# Altium schematic sheet STM32lab.SchDoc
size A3; SheetNumber: 1; SheetTotal: 1; SPICEModelCacheLXBDUELC: <root> / <DocumentId>LXBDUELC</DocumentId> / </root>
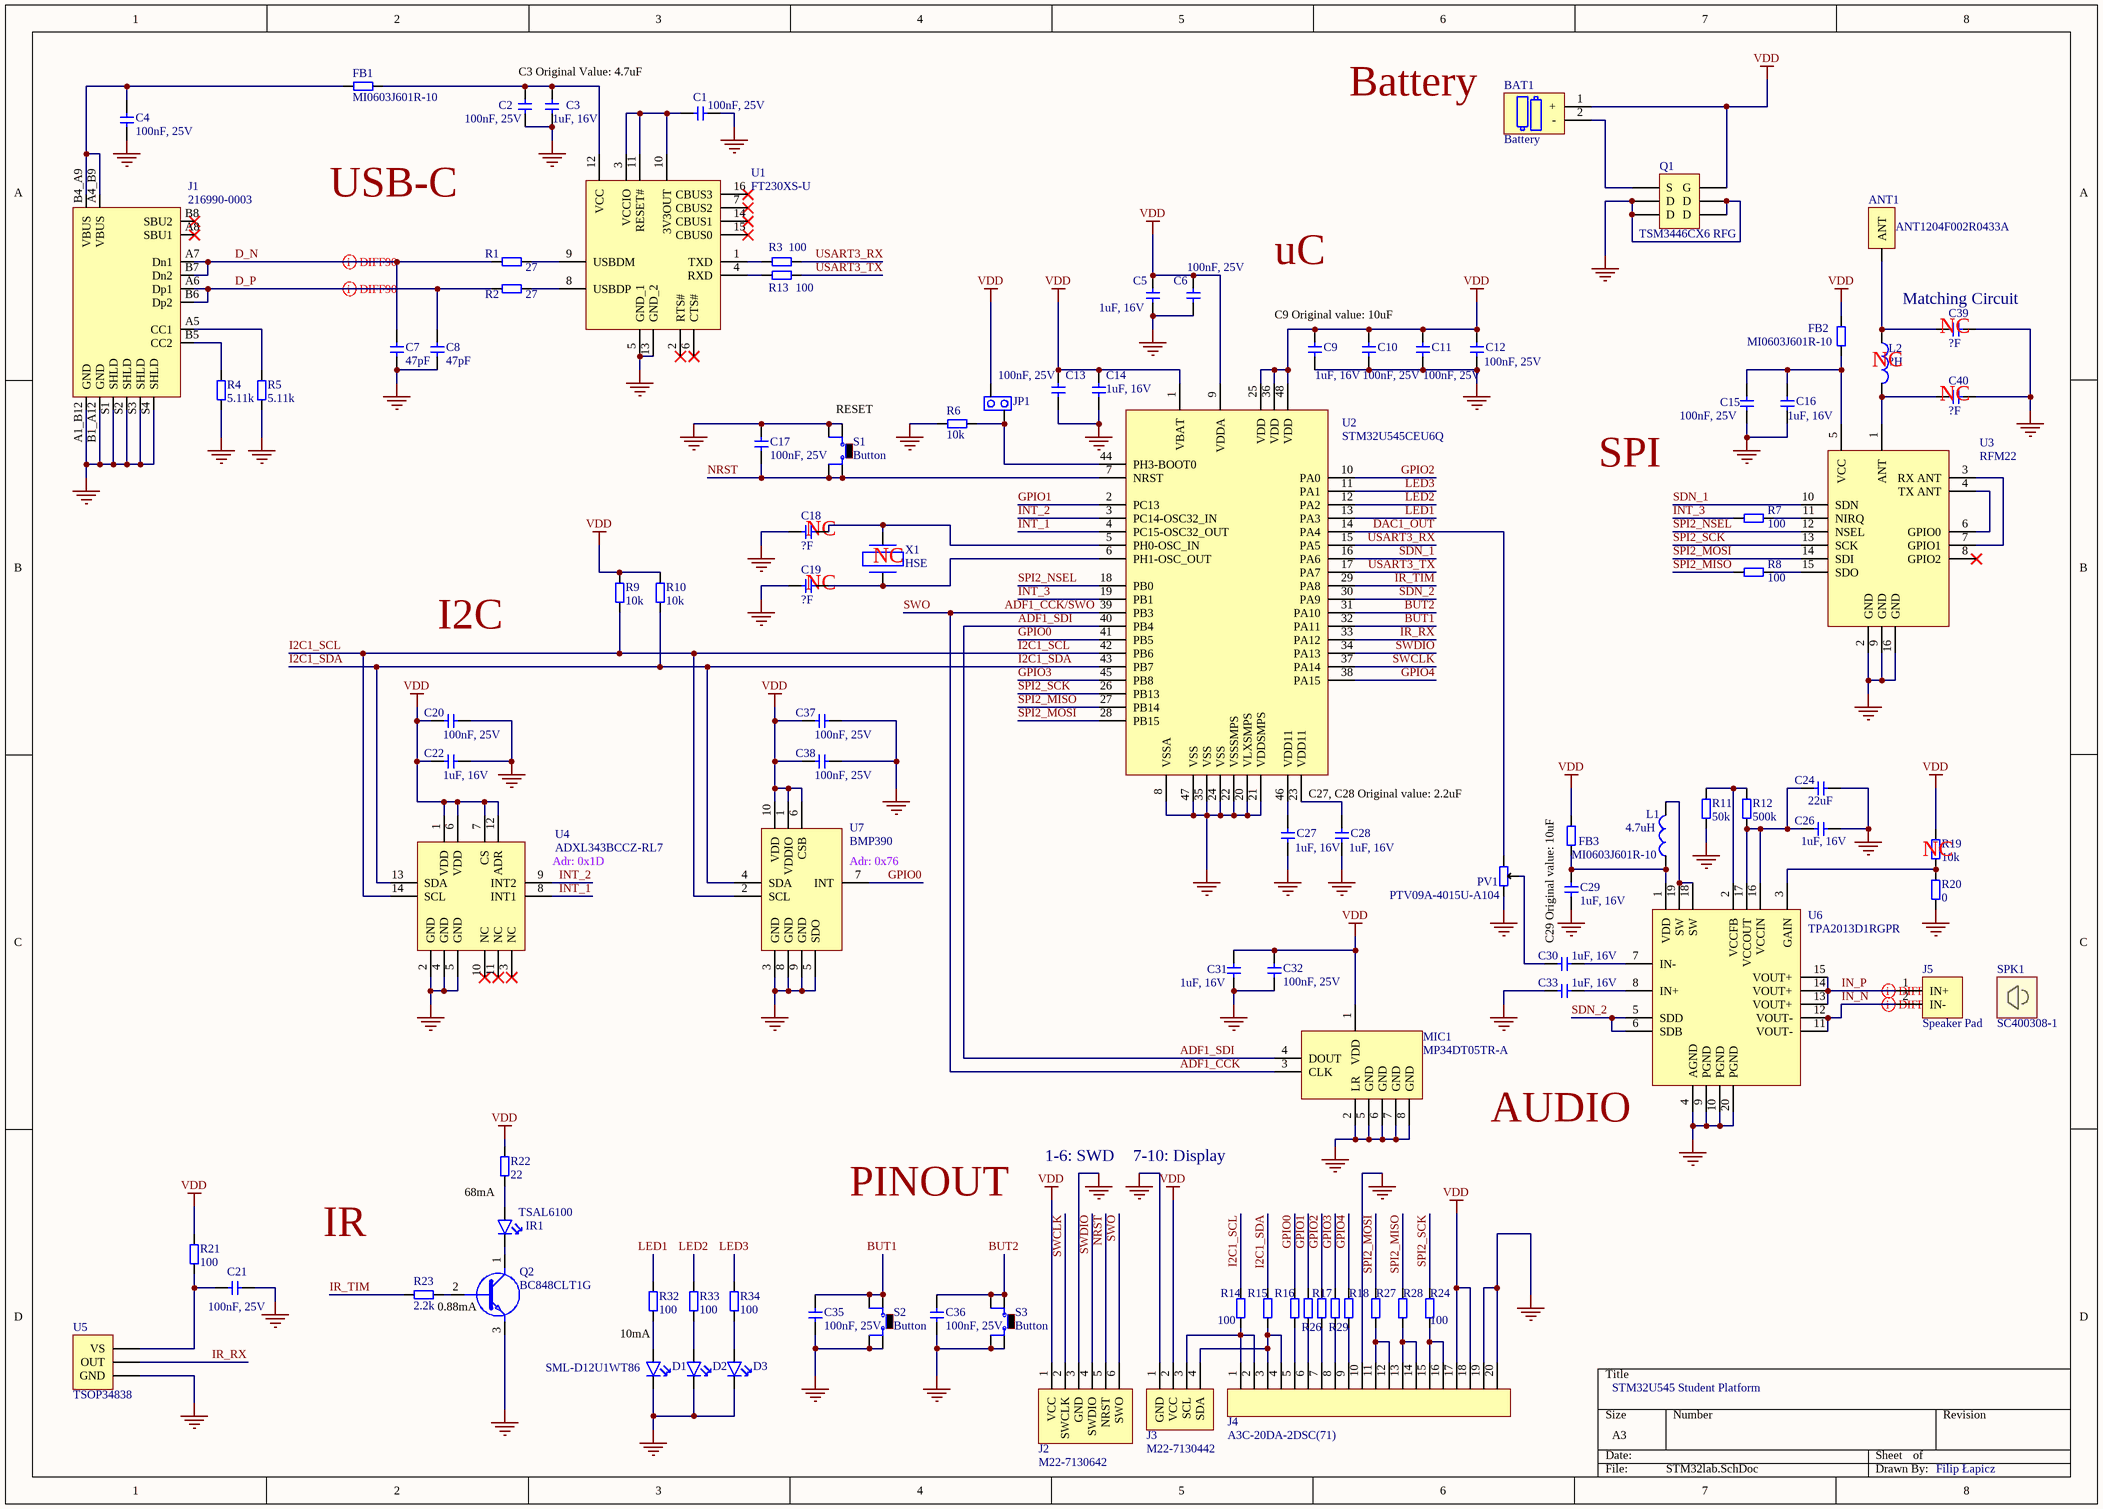
[diagram p0: STM32lab.SchDoc]

## Parts
ANT1  ANT1204F002R0433A  [CHIP_R0433A_YAG]
BAT1  Battery  [2462]
C1  100nF, 25V  [CAPC1608X90N]
C2  100nF, 25V  [CAPC1608X90N]
C3  1uF, 16V  [CAPC1608X90N]
C4  100nF, 25V  [CAPC1608X90N]
C5  1uF, 16V  [CAPC1608X90N]
C6  100nF, 25V  [CAPC1608X90N]
C7  47pF  [CAPC1608X90N]
C8  47pF  [CAPC1608X90N]
C9  1uF, 16V  [CAPC1608X90N]
C10  100nF, 25V  [CAPC1608X90N]
C11  100nF, 25V  [CAPC1608X90N]
C12  100nF, 25V  [CAPC1608X90N]
C13  100nF, 25V  [CAPC1608X90N]
C14  1uF, 16V  [CAPC1608X90N]
C15  100nF, 25V  [CAPC1608X90N]
C16  1uF, 16V  [CAPC1608X90N]
C17  100nF, 25V  [CAPC1608X90N]
C18  ?F  [CAPC1608X90N]
C19  ?F  [CAPC1608X90N]
C20  100nF, 25V  [CAPC1608X90N]
C21  100nF, 25V  [CAPC1608X90N]
C22  1uF, 16V  [CAPC1608X90N]
C24  22uF  [CAPC1608X90N]
C26  1uF, 16V  [CAPC1608X90N]
C27  1uF, 16V  [CAPC1608X90N]
C28  1uF, 16V  [CAPC1608X90N]
C29  1uF, 16V  [CAPC1608X90N]
C30  1uF, 16V  [CAPC1608X90N]
C31  1uF, 16V  [CAPC1608X90N]
C32  100nF, 25V  [CAPC1608X90N]
C33  1uF, 16V  [CAPC1608X90N]
C35  100nF, 25V  [CAPC1608X90N]
C36  100nF, 25V  [CAPC1608X90N]
C37  100nF, 25V  [CAPC1608X90N]
C38  100nF, 25V  [CAPC1608X90N]
C39  ?F  [CAPC1608X90N]
C40  ?F  [CAPC1608X90N]
D1  SML-D12U1WT86  [LEDC1608X65N]
D2  SML-D12U1WT86  [LEDC1608X65N]  (value not drawn)
D3  SML-D12U1WT86  [LEDC1608X65N]  (value not drawn)
FB1  MI0603J601R-10  [RESC1608X55N]
FB2  MI0603J601R-10  [RESC1608X55N]
FB3  MI0603J601R-10  [RESC1608X55N]
IR1  TSAL6100  [TSAL]
J1  216990-0003  [MOLEX_2169900003]
J2  M22-7130642  [6-wire]
J3  M22-7130442  [4-wire]
J4  A3C-20DA-2DSC(71)  [20-wire]
J5  Speaker Pad  [Pad]
JP1  (no value)  [10129378902002BLF]
L1  4.7uH  [RESC1608X55N]
L2  ?H  [RESC1608X55N]
MIC1  MP34DT05TR-A  [MP34DT05TRA]
PV1  PTV09A-4015U-A104  [PTV09A-4015U-A104]
Q1  TSM3446CX6 RFG  [TRANS_TSM3446CX6_RFG]
Q2  BC848CLT1G  [SOT-23TO-236_318-08_ONS]
R1  27  [RESC1608X55N]
R2  27  [RESC1608X55N]
R3  100  [RESC1608X55N]
R4  5.11k  [RESC1608X55N]
R5  5.11k  [RESC1608X55N]
R6  10k  [RESC1608X55N]
R7  100  [RESC1608X55N]
R8  100  [RESC1608X55N]
R9  10k  [RESC1608X55N]
R10  10k  [RESC1608X55N]
R11  50k  [RESC1608X55N]
R12  500k  [RESC1608X55N]
R13  100  [RESC1608X55N]
R14  100  [RESC1608X55N]
R15  100  [RESC1608X55N]  (value not drawn)
R16  100  [RESC1608X55N]  (value not drawn)
R17  100  [RESC1608X55N]  (value not drawn)
R18  100  [RESC1608X55N]  (value not drawn)
R19  10k  [RESC1608X55N]
R20  0  [RESC1608X55N]
R21  100  [RESC1608X55N]
R22  22  [RESC1608X55N]
R23  2.2k  [RESC1608X55N]
R24  100  [RESC1608X55N]  (value not drawn)
R26  100  [RESC1608X55N]
R27  100  [RESC1608X55N]  (value not drawn)
R28  100  [RESC1608X55N]  (value not drawn)
R29  100  [RESC1608X55N]  (value not drawn)
R32  100  [RESC1608X55N]
R33  100  [RESC1608X55N]
R34  100  [RESC1608X55N]
S1  Button  [TS026650BK260SCRD]
S2  Button  [TS026650BK260SCRD]
S3  Button  [TS026650BK260SCRD]
SPK1  SC400308-1  [SC400308]
U1  FT230XS-U  [SOP64P599X175-16N]
U2  STM32U545CEU6Q  [UFQFPN-48_STM]
U3  RFM22  [RFM22B-S2_HRF]
U4  ADXL343BCCZ-RL7  [PQFN80P300X500X100-14N]
U5  TSOP34838  [TO_TSOP31236_VIS]
U6  TPA2013D1RGPR  [QFN50P400X400X100-21N-D]
U7  BMP390  [10LGA_2X2X0p75_BOS]
X1  HSE  [HC49USMFF5F1873728MHZ]

## Nets
GND: C1.1 C2.1 C3.1 C4.1 C5.1 C6.1 C7.1 C8.1 C9.1 C10.1 C11.1 C12.1 C13.1 C14.1 C15.1 C16.1 C17.2 C18.1 C19.1 C20.2 C21.1 C22.2 C24.2 C26.1 C27.1 C28.1 C29.2 C31.1 C32.1 C33.1 C35.1 C36.1 C37.1 C38.1 C39.2 C40.2 D1.2 D2.2 D3.2 J1.A1_B12(GND) J1.B1_A12(GND) J1.S1(SHLD) J1.S2(SHLD) J1.S3(SHLD) J1.S4(SHLD) J2.3(GND) J3.1(GND) J4.10 J4.19 J4.20 MIC1.2(LR) MIC1.5(GND) MIC1.6(GND) MIC1.7(GND) MIC1.8(GND) PV1.3 Q1.2(D) Q1.3(D) Q1.5(D) Q1.6(D) Q2.3(E) R4.1 R5.1 R6.2 R11.1 R20.1 S1.1 S1.2 S2.3 S2.4 S3.3 S3.4 U1.5(GND_1) U1.13(GND_2) U2.8(VSSA) U2.20(VLXSMPS) U2.21(VDDSMPS) U2.22(VSSSMPS) U2.24(VSS) U2.35(VSS) U2.47(VSS) U3.2(GND) U3.9(GND) U3.16(GND) U4.2(GND) U4.4(GND) U4.5(GND) U5.2(GND) U6.4(AGND) U6.9(PGND) U6.10(PGND) U6.20(PGND) U7.3(GND) U7.5(SDO) U7.8(GND) U7.9(GND)
VDD: BAT1.1(+) C5.2 C6.2 C9.2 C10.2 C11.2 C12.2 C13.2 C14.2 C20.1 C22.1 C31.2 C32.2 C37.2 C38.2 FB2.2 FB3.2 J2.1(VCC) J3.2(VCC) J4.17 J4.18 JP1.1 MIC1.1(VDD) Q1.4(G) R9.2 R10.2 R19.2 R21.2 R22.2 U2.1(VBAT) U2.9(VDDA) U2.25(VDD) U2.36(VDD) U2.48(VDD) U4.1(VDD) U4.6(VDD) U4.7(CS) U4.12(ADR) U7.1(VDDIO) U7.6(CSB) U7.10(VDD)
ADF1_CCK: J2.6(SWO) MIC1.3(CLK) U2.39(PB3)  [also labelled ADF1_CCK/SWO, SWO]
ADF1_SDI: MIC1.4(DOUT) U2.40(PB4)
BUT1: C35.2 S2.1 S2.2 U2.32(PA11)
BUT2: C36.2 S3.1 S3.2 U2.31(PA10)
D_N: C7.2 J1.A7(Dn1) J1.B7(Dn2) R1.1
D_P: C8.2 J1.A6(Dp1) J1.B6(Dp2) R2.1
DAC1_OUT: PV1.1 U2.14(PA4)
GPIO0: R16.1 U2.41(PB5) U7.7(INT)
GPIO1: R26.1 U2.2(PC13)
GPIO2: R17.1 U2.10(PA0)
GPIO3: R29.1 U2.45(PB8)
GPIO4: R18.1 U2.38(PA15)
I2C1_SCL: R9.1 R14.1 U2.42(PB6) U4.14(SCL) U7.2(SCL)
I2C1_SDA: R10.1 R15.1 U2.43(PB7) U4.13(SDA) U7.4(SDA)
IN_N: J5.2(IN-) U6.11(VOUT-) U6.12(VOUT-)
IN_P: J5.1(IN+) U6.13(VOUT+) U6.14(VOUT+) U6.15(VOUT+)
INT_1: U2.4(PC15-OSC32_OUT) U4.8(INT1)
INT_2: U2.3(PC14-OSC32_IN) U4.9(INT2)
INT_3: R7.1 U2.19(PB1)
IR_RX: U2.33(PA12) U5.1(OUT)
IR_TIM: R23.1 U2.29(PA8)
LED1: R32.2 U2.13(PA3)
LED2: R33.2 U2.12(PA2)
LED3: R34.2 U2.11(PA1)
NRST: C17.1 J2.5(NRST) S1.3 S1.4 U2.7(NRST)
SDN_1: U2.16(PA6) U3.10(SDN)
SDN_2: U2.30(PA9) U6.5(SDD) U6.6(SDB)
SPI2_MISO: R8.1 R28.1 U2.27(PB14)
SPI2_MOSI: R27.1 U2.28(PB15) U3.14(SDI)
SPI2_NSEL: U2.18(PB0) U3.12(NSEL)
SPI2_SCK: R24.1 U2.26(PB13) U3.13(SCK)
SWCLK: J2.2(SWCLK) U2.37(PA14)
SWDIO: J2.4(SWDIO) U2.34(PA13)
USART3_RX: R3.2 U2.15(PA5)
USART3_TX: R13.2 U2.17(PA7)
NetANT1_1: ANT1.1(ANT) C39.1 L2.1
NetBAT1_2: BAT1.2(-) Q1.1(S)
NetC1_2: C1.2 U1.3(VCCIO) U1.10(3V3OUT) U1.11(RESET#)
NetC2_2: C2.2 C3.2 FB1.2 U1.12(VCC)
NetC4_2: C4.2 FB1.1 J1.A4_B9(VBUS) J1.B4_A9(VBUS)
NetC15_2: C15.2 C16.2 FB2.1 U3.5(VCC)
NetC18_2: C18.2 U2.5(PH0-OSC_IN) X1.1
NetC19_2: C19.2 U2.6(PH1-OSC_OUT) X1.2
NetC21_2: C21.2 R21.1 U5.3(VS)
NetC24_1: C24.1 C26.2 R12.1 U6.16(VCCIN) U6.17(VCCOUT)
NetC27_2: C27.2 U2.46(VDD11)
NetC28_2: C28.2 U2.23(VDD11)
NetC29_1: C29.1 FB3.1 L1.1 U6.1(VDD)
NetC30_1: C30.1 PV1.2
NetC30_2: C30.2 U6.7(IN-)
NetC33_2: C33.2 U6.8(IN+)
NetC40_1: C40.1 L2.2 U3.1(ANT)
NetD1_1: D1.1 R32.1
NetD2_1: D2.1 R33.1
NetD3_1: D3.1 R34.1
NetIR1_1: IR1.1 R22.1
NetIR1_2: IR1.2 Q2.1(C)
NetJ1_A5: J1.A5(CC1) R5.2
NetJ1_B5: J1.B5(CC2) R4.2
NetJ3_3: J3.3(SCL) J4.1 J4.2 R14.2
NetJ3_4: J3.4(SDA) J4.3 J4.4 R15.2
NetJ4_5: J4.5 R16.2
NetJ4_6: J4.6 R26.2
NetJ4_7: J4.7 R17.2
NetJ4_8: J4.8 R29.2
NetJ4_9: J4.9 R18.2
NetJ4_11: J4.11 J4.12 R27.2
NetJ4_13: J4.13 J4.14 R28.2
NetJ4_15: J4.15 J4.16 R24.2
NetJP1_2: JP1.2 R6.1 U2.44(PH3-BOOT0)
NetL1_2: L1.2 U6.18(SW) U6.19(SW)
NetQ2_2: Q2.2(B) R23.2
NetR1_2: R1.2 U1.9(USBDM)
NetR2_2: R2.2 U1.8(USBDP)
NetR3_1: R3.1 U1.1(TXD)
NetR7_2: R7.2 U3.11(NIRQ)
NetR8_2: R8.2 U3.15(SDO)
NetR11_2: R11.2 R12.2 U6.2(VCCFB)
NetR13_1: R13.1 U1.4(RXD)
NetR19_1: R19.1 R20.2 U6.3(GAIN)
NetU3_3: U3.3(RX_ANT) U3.7(GPIO1)
NetU3_4: U3.4(TX_ANT) U3.6(GPIO0)

Not connected (* = marked no-connect by the designer): J1 A8(SBU1)* B8(SBU2)*; U1 2(RTS#)* 6(CTS#)* 7(CBUS2)* 14(CBUS1)* 15(CBUS0)* 16(CBUS3)*; U3 8(GPIO2)*; U4 3(NC)* 10(NC)* 11(NC)*

## Layout directives
differential pair: D_N, D_P, IN_N, IN_P

## Notes on the sheet
- C3 Original Value: 4.7uF
- Battery
- USB-C
- uC
- C9 Original value: 10uF
- (near C39) Matching Circuit
- (near L2) NC
- (near C39) NC
- (near S1) RESET
- (near C40) NC
- SPI
- (near C18) NC
- (near X1) NC
- I2C
- (near C19) NC
- (near U2) C27, C28 Original value: 2.2uF
- (near R19) NC
- (near U4) Adr: 0x1D
- (near U7) Adr: 0x76
- C29 Original value: 10uF
- AUDIO
- 1-6: SWD
- 7-10: Display
- IR
- 68mA
- PINOUT
- (near Q2) 0.88mA
- 10mA
- STM32U545 Student Platform
- Filip Łapicz

## Library data of the parts
ANT1 = ANT1204F002R0433A: Antennas 433MHz 50 Ohm 1W CHIP ANTENNA; Manufacturer: Pulse; Supplier: Mouser; Supplier Part Number: 603-ANT1204F002R0433; Manufacturer Part Number: ANT1204F002R0433A; RoHS: No; Category: RF Antennas; Stock: 6367; Pricing: 1=1,03, 10=0,93, 50=0,93, 100=0,713, 1000=0,677, 10000=0,62 (USD); ComponentLink1URL: http://datasheet.octopart.com/ANT1204F002R0433A-Pulse-datasheet-159152890.pdf?src-supplier=Avnet; ComponentLink1Description: http://datasheet.octopart.com/ANT1204F002R0433A-Pulse-datasheet-159152890.pdf?src-supplier=Avnet; ComponentLink2URL: http://datasheet.octopart.com/ANT1204F002R0433A-Pulse-datasheet-159152890.pdf?src-supplier=Digikey; ComponentLink2Description: http://datasheet.octopart.com/ANT1204F002R0433A-Pulse-datasheet-159152890.pdf?src-supplier=Digikey; ComponentLink3URL: http://datasheet.octopart.com/ANT1204F002R0433A-Pulse-datasheet-159152890.pdf?src-supplier=Arrow+Electronics; ComponentLink3Description: http://datasheet.octopart.com/ANT1204F002R0433A-Pulse-datasheet-159152890.pdf?src-supplier=Arrow+Electronics; ComponentLink4URL: http://datasheet.octopart.com/ANT1204F002R0433A-Pulse-datasheet-159152890.pdf?src-supplier=Mouser; ComponentLink4Description: http://datasheet.octopart.com/ANT1204F002R0433A-Pulse-datasheet-159152890.pdf?src-supplier=Mouser; ComponentLink5URL: http://datasheet.octopart.com/ANT1204F002R0433A-Pulse-datasheet-159152890.pdf?src-supplier=Onlinecomponents.com; ComponentLink5Description: http://datasheet.octopart.com/ANT1204F002R0433A-Pulse-datasheet-159152890.pdf?src-supplier=Onlinecomponents.com; ComponentLink6URL: http://datasheet.octopart.com/ANT1204F002R0433A-Pulse-datasheet-159152890.pdf?src-supplier=Verical; ComponentLink6Description: http://datasheet.octopart.com/ANT1204F002R0433A-Pulse-datasheet-159152890.pdf?src-supplier=Verical; ComponentLink7URL: http://datasheet.octopart.com/ANT1204F002R0433A-Pulse-datasheet-159152890.pdf?src-supplier=TTI; ComponentLink7Description: http://datasheet.octopart.com/ANT1204F002R0433A-Pulse-datasheet-159152890.pdf?src-supplier=TTI; ComponentLink8URL: https://datasheet.octopart.com/ANT1204F002R0433A-Pulse-datasheet-159152890.pdf?src-supplier=Sager+Electronics; ComponentLink8Description: https://datasheet.octopart.com/ANT1204F002R0433A-Pulse-datasheet-159152890.pdf?src-supplier=Sager+Electronics; ComponentLink9URL: http://datasheet.octopart.com/ANT1204F002R0433A-Pulse-datasheet-159152890.pdf?src-supplier=Electro+Sonic; ComponentLink9Description: http://datasheet.octopart.com/ANT1204F002R0433A-Pulse-datasheet-159152890.pdf?src-supplier=Electro+Sonic
C1 C2 C4 C6 C10-C13 C15 C17 C20 C21 C32 C35-C38 = TMK107BJ104KA-T: Multilayer Ceramic Capacitors MLCC - SMD/SMT 25V 0.1uF X5R 0603 10 %; Manufacturer: Samsung; Manufacturer Part Number: CL10B104JB8NNND; Dielectric: X7R; Voltage Rating (DC): 50V; Tolerance: 5%; Supplier: Mouser; Supplier Part Number: 187-CL10B104JB8NNND; RoHS: Yes; Category: Ceramic Capacitors; Stock: 98593; Pricing: 1=0,1, 10=0,018, 50=0,018, 100=0,017, 1000=0,01, 10000=0,005 (USD); Case/Package: 0603; Value: 100nF; RoHS Compliant: Yes; ComponentLink1URL: https://datasheet.octopart.com/TMK107BJ104KA-T-Taiyo-Yuden-datasheet-120265.pdf?src-supplier=Digikey; ComponentLink1Description: https://datasheet.octopart.com/TMK107BJ104KA-T-Taiyo-Yuden-datasheet-120265.pdf?src-supplier=Digikey
C3 C5 C9 C14 C16 C22 C26-C31 C33 = EMK107BJ105MA-T: Multilayer Ceramic Capacitors (High dielectric type), 16V, 1 uF, ± 20 %, 0603, X5R, RoHS; Manufacturer: Taiyo Yuden; Tolerance: 20%; Supplier: Mouser; Supplier Part Number: 963-EMK107BJ105MA-T; Manufacturer Part Number: EMK107BJ105MA-T; RoHS: Yes; Category: Ceramic Capacitors; Stock: 18439; Pricing: 1=0,1, 10=0,033, 50=0,033, 100=0,016, 1000=0,01, 10000=0,008 (USD); Mounting Technology: Surface Mount; Case/Package: 0603; Case Code (Imperial): 0603; Case Code (Metric): 1608; Weight: 7.1E-05oz; Min Operating Temperature: -55°C; Max Operating Temperature: 85°C; Value: 1uF; Voltage Rating (DC): 16V; Packaging: Tape and Reel; Dielectric: X5R; Termination: SMD/SMT; Voltage: 16V; Series: M; Construction: Flat; Length: 1.6mm; Width: 0.8mm; Height: 0.8mm; Depth: 0.8mm; Radiation Hardening: No; Lead Free: Lead Free; Halogen Free: Halogen Free; RoHS Compliant: Yes; ComponentLink1URL: https://datasheet.ciiva.com/11596/emk107bj105ma-t-ss-11596745.pdf?src-supplier=Avnet; ComponentLink1Description: https://datasheet.ciiva.com/11596/emk107bj105ma-t-ss-11596745.pdf?src-supplier=Avnet
C7 C8 C18 C19 C24 C39 C40 = Capacitor: No model capacitor
D1-D3 = SML-D12U1WT86: Single Color LED, Red, Milky White, 1.2mm; Manufacturer: Rohm; Shape: Rectangular; Forward Current: 20mA; Luminous Intensity-Nom: 63mcd; Channels: 1; Overall Height: 0.55mm; Supplier: Mouser; Supplier Part Number: 755-SML-D12U1WT86; Manufacturer Part Number: SML-D12U1WT86; RoHS: Yes; Category: LEDs; Stock: 58955; Pricing: 1=0,19, 10=0,102, 50=0,102, 100=0,044, 1000=0,037, 10000=0,026 (USD); Mounting Technology: Surface Mount; Pins: 2; Color: Red; Min Operating Temperature: -40°C; Max Operating Temperature: 85°C; Lens Style: MILKY WHITE; Optoelectronic Device Type: SINGLE COLOR LED; Packaging: Tape and Reel; Size: 1.2mm; Terminal Pitch: 1.65mm; Reach SVHC Compliant: Yes; RoHS Compliant: Yes; ComponentLink1URL: https://datasheet.ciiva.com:443/pdfs/VipMasterIC/IC/ROHM/ROHM-S-A0002134492/ROHM-S-A0002134492-1.pdf?src-supplier=IHS+Markit; ComponentLink1Description: https://datasheet.ciiva.com:443/pdfs/VipMasterIC/IC/ROHM/ROHM-S-A0002134492/ROHM-S-A0002134492-1.pdf?src-supplier=IHS+Markit; ComponentLink2URL: https://www.rohm.com/datasheet/SML-D12U1W?src-supplier=Digikey; ComponentLink2Description: https://www.rohm.com/datasheet/SML-D12U1W?src-supplier=Digikey; ComponentLink3URL: https://datasheet.octopart.com/SML-D12U1WT86-Rohm-datasheet-68298509.pdf?src-supplier=Future+Electronics; ComponentLink3Description: https://datasheet.octopart.com/SML-D12U1WT86-Rohm-datasheet-68298509.pdf?src-supplier=Future+Electronics; ComponentLink4URL: https://datasheet.octopart.com/SML-D12U1WT86-ROHM-datasheet-142144710.pdf?src-supplier=TME; ComponentLink4Description: https://datasheet.octopart.com/SML-D12U1WT86-ROHM-datasheet-142144710.pdf?src-supplier=TME
FB1-FB3 = MI0603J601R-10: Ferrite Chip, 1 Function(s), 1A, 2 Pin(s); Manufacturer: Laird; DC Resistance-Max: 200mR; Clock Frequency: 100MHz; Channels: 1; Output Impedance: 600R; Supplier: Mouser; Supplier Part Number: 875-MI0603J601R-10; Manufacturer Part Number: MI0603J601R-10; RoHS: Yes; Category: Ferrite Beads and Chips; Stock: 117417; Pricing: 1=0,12, 10=0,072, 50=0,072, 100=0,05, 1000=0,029, 10000=0,027 (USD); Mounting Technology: Surface Mount; Material: Ferrite; Case Code: 0603; Terminal Finish: Tin; Min Operating Temperature: -55°C; Max Operating Temperature: 125°C; JESD-609 Code: e3; Construction: Chip Bead; Filter Type: FERRITE CHIP; Min Frequency: 100MHz; Manufacturer Series: MI0603J601R; Packaging: Tape and Reel; Current Rating: 1A; Series: MI0603J601R-10; Length: 1.6mm; Width: 0.8mm; Height: 0.8mm; RoHS Compliant: Yes; ComponentLink1URL: https://datasheet.ciiva.com:443/pdfs/VipMasterIC/IC/STWD/STWDS00461/STWDS00461-1.pdf?src-supplier=IHS+Markit; ComponentLink1Description: https://datasheet.ciiva.com:443/pdfs/VipMasterIC/IC/STWD/STWDS00461/STWDS00461-1.pdf?src-supplier=IHS+Markit; ComponentLink2URL: http://www.farnell.com/datasheets/1685984.pdf?src-supplier=Farnell; ComponentLink2Description: http://www.farnell.com/datasheets/1685984.pdf?src-supplier=Farnell; ComponentLink3URL: https://assets.lairdtech.com/home/brandworld/files/MI0603J601R-10.pdf?src-supplier=Digikey; ComponentLink3Description: https://assets.lairdtech.com/home/brandworld/files/MI0603J601R-10.pdf?src-supplier=Digikey; ComponentLink4URL: http://staging.lairdtech.com/WorkArea/linkit.aspx?LinkIdentifier=id&ItemID=5721&src-supplier=Mouser; ComponentLink4Description: http://staging.lairdtech.com/WorkArea/linkit.aspx?LinkIdentifier=id&ItemID=5721&src-supplier=Mouser
IR1 = TSAL6100: λP=940nm VF=1.35V; Manufacturer: Vishay; Supplier: Mouser; Supplier Part Number: 782-TSAL6100; Manufacturer Part Number: TSAL6100; RoHS: No; Category: LEDs; Stock: 23278; Pricing: 1=0,39, 10=0,24, 50=0,24, 100=0,139, 1000=0,123, 10000=0,12 (USD); ComponentLink1URL: https://datasheet.ciiva.com/11769/0900766b80e1b0e6-11769888.pdf?src-supplier=Rs; ComponentLink1Description: https://datasheet.ciiva.com/11769/0900766b80e1b0e6-11769888.pdf?src-supplier=Rs; ComponentLink2URL: https://datasheet.ciiva.com/16397/tsal6100-16397738.pdf?src-supplier=Future+Electronics; ComponentLink2Description: https://datasheet.ciiva.com/16397/tsal6100-16397738.pdf?src-supplier=Future+Electronics
J1 = 216990-0003: USB Type C - Connector, Mid-mount, SMT, CH0.58, 16pos | Molex Incorporated 216990-0003; USB Standard: 6108USBStandard; Current Rating: 1.25A; Gender: 4472Gender; Number of Contacts: 16NUMBER; Voltage Rating: 30V; Supplier: Mouser; Supplier Part Number: 538-216990-0003; Manufacturer: Molex; Manufacturer Part Number: 216990-0003; RoHS: No; Category: Connectors; Stock: 8277; Pricing: 1=0,63, 10=0,524, 50=0,524, 100=0,44, 1000=0,44, 10000=0,44 (USD); Contact Material: 153,157ConductorMaterial; Min Operating Temperature: -40°C; Max Operating Temperature: 85°C
J2 = M22-7130642: Board Connector, 6 Contact(s), 1 Row(s), Female, Straight, 0.079 inch Pitch, Solder Terminal, Black Insulator, Socket; Manufacturer: Harwin; Option: General Purpose; Additional Feature: ROHS COMPLIANT; Contact Pattern: RECTANGULAR; Contact Resistance: 20mR; Contact Style: SQ PIN-SKT; Dielectric Withstanding Voltage (AC): 500V; Filter Feature: No; Insertion Force-Max: 2.0016N; Insulation Resistance: 1GR; Number Of Connectors: 1; Rated Current (Signal): 1A; Number of Contacts: 6; Withdrawl Force-Min: 0.1946N; Body Breadth: 0.094inch; Body Depth: 0.173inch; Body Length: 0.472inch; Plating Thickness: 50uin; Reference Standard: UL; Reliability: COMMERCIAL; Supplier: Mouser; Supplier Part Number: 855-M22-7130642; Manufacturer Part Number: M22-7130642; RoHS: Yes; Category: Headers and Wire Housings; Stock: 982; Pricing: 1=1,32, 10=1,26, 50=0,877, 100=0,824, 1000=0,747, 10000=0,638 (USD); Mounting Technology: Board; Contact Material: Bronze; Contact Finish - Mating: GOLD; Contact Finish - Termination: Tin (Sn) - with Nickel (Ni) barrier; Insulation Color: Black; Insulation Material: Polymer; Min Operating Temperature: -40°C; Max Operating Temperature: 105°C; Connector Type: BOARD CONNECTOR; JESD-609 Code: e3; Body/Shell Style: SOCKET; Contact Gender: Female; Mixed Contacts: No; Mounting Style: STRAIGHT; Number Of PCB Rows: 1; Number of Rows Loaded: 1; PCB Contact Pattern: RECTANGULAR; Termination: Solder; Mating Contact Pitch: 0.079inch; Terminal Length: 0.102inch; Terminal Pitch: 2mm; Flammability Rating: UL94 V-0; DIN Conformance: No; IEC Conformance: No; MIL Conformance: No; Reach SVHC Compliant: Yes; RoHS Compliant: Yes; ComponentLink1URL: https://datasheet.ciiva.com:443/pdfs/VipMasterIC/IC/HRWN/HRWN-S-A0002541722/HRWN-S-A0004894629-1.pdf?src-supplier=IHS+Markit; ComponentLink1Description: https://datasheet.ciiva.com:443/pdfs/VipMasterIC/IC/HRWN/HRWN-S-A0002541722/HRWN-S-A0004894629-1.pdf?src-supplier=IHS+Markit; ComponentLink2URL: https://datasheet.ciiva.com/11746/0900766b80f0800f-11746972.pdf?src-supplier=Rs; ComponentLink2Description: https://datasheet.ciiva.com/11746/0900766b80f0800f-11746972.pdf?src-supplier=Rs; ComponentLink3URL: https://datasheet.ciiva.com/23592/27454-23592801.pdf?src-supplier=Newark; ComponentLink3Description: https://datasheet.ciiva.com/23592/27454-23592801.pdf?src-supplier=Newark; ComponentLink4URL: https://datasheet.ciiva.com/8046/27454-8046967.pdf?src-supplier=Element14; ComponentLink4Description: https://datasheet.ciiva.com/8046/27454-8046967.pdf?src-supplier=Element14; ComponentLink5URL: https://datasheet.ciiva.com/411/m22-713-411295.pdf?src-supplier=Digikey; ComponentLink5Description: https://datasheet.ciiva.com/411/m22-713-411295.pdf?src-supplier=Digikey
J3 = M22-7130442: Board Connector, 4 Contact(s), 1 Row(s), Female, Straight, 0.079 inch Pitch, Solder Terminal, Black Insulator, Socket; Manufacturer: Harwin; Option: General Purpose; Additional Feature: ROHS COMPLIANT; Contact Pattern: RECTANGULAR; Contact Resistance: 20mR; Contact Style: SQ PIN-SKT; Dielectric Withstanding Voltage (AC): 500V; Filter Feature: No; Insertion Force-Max: 2.0016N; Insulation Resistance: 1GR; Number Of Connectors: 1; Rated Current (Signal): 1A; Number of Contacts: 4; Withdrawl Force-Min: 0.1946N; Body Breadth: 0.094inch; Body Depth: 0.173inch; Body Length: 0.315inch; Plating Thickness: 50uin; Reference Standard: UL; Reliability: COMMERCIAL; Supplier: Mouser; Supplier Part Number: 855-M22-7130442; Manufacturer Part Number: M22-7130442; RoHS: Yes; Category: Headers and Wire Housings; Stock: 1209; Pricing: 1=1,42, 10=1,2, 50=1,12, 100=1,08, 1000=0,885, 10000=0,688 (USD); Mounting Technology: Board; Contact Material: Bronze; Contact Finish - Mating: GOLD; Contact Finish - Termination: Tin (Sn); Insulation Color: Black; Insulation Material: Polymer; Min Operating Temperature: -40°C; Max Operating Temperature: 105°C; Connector Type: BOARD CONNECTOR; JESD-609 Code: e3; Body/Shell Style: SOCKET; Contact Gender: Female; Mixed Contacts: No; Mounting Style: STRAIGHT; Number Of PCB Rows: 1; Number of Rows Loaded: 1; PCB Contact Pattern: RECTANGULAR; Termination: Solder; Mating Contact Pitch: 0.079inch; Terminal Length: 0.102inch; Terminal Pitch: 2mm; Flammability Rating: UL94 V-0; DIN Conformance: No; IEC Conformance: No; MIL Conformance: No; Reach SVHC Compliant: Yes; RoHS Compliant: Yes; ComponentLink1URL: https://datasheet.ciiva.com:443/pdfs/VipMasterIC/IC/HRWN/HRWN-S-A0002541722/HRWN-S-A0004894629-1.pdf?src-supplier=IHS+Markit; ComponentLink1Description: https://datasheet.ciiva.com:443/pdfs/VipMasterIC/IC/HRWN/HRWN-S-A0002541722/HRWN-S-A0004894629-1.pdf?src-supplier=IHS+Markit; ComponentLink2URL: https://datasheet.ciiva.com/11747/0900766b80da60bb-11747426.pdf?src-supplier=Rs; ComponentLink2Description: https://datasheet.ciiva.com/11747/0900766b80da60bb-11747426.pdf?src-supplier=Rs; ComponentLink3URL: https://datasheet.ciiva.com/23592/1693768-23592608.pdf?src-supplier=Newark; ComponentLink3Description: https://datasheet.ciiva.com/23592/1693768-23592608.pdf?src-supplier=Newark; ComponentLink4URL: https://datasheet.ciiva.com/411/m22-713-411291.pdf?src-supplier=Digikey; ComponentLink4Description: https://datasheet.ciiva.com/411/m22-713-411291.pdf?src-supplier=Digikey
J4 = A3C-20DA-2DSC(71): Board Connector; Manufacturer: Hirose; Supplier: Mouser; Supplier Part Number: 798-A3C-20DA-2DSC71; Manufacturer Part Number: A3C-20DA-2DSC(71); RoHS: Yes; Category: Connectors; Stock: 5726; Pricing: 1=2,14, 10=1,75, 50=1,75, 100=1,75, 1000=1,16, 10000=1,08 (USD); Connector Type: BOARD CONNECTOR; Manufacturer Series: A3C-20DA-2DSC(71); RoHS Compliant: Yes; ComponentLink1URL: https://datasheet.ciiva.com:443/pdfs/VipMasterIC/IC/HIRO/HIRO-S-A0008069061/HIRO-S-A0008410557-1.pdf?src-supplier=IHS+Markit; ComponentLink1Description: https://datasheet.ciiva.com:443/pdfs/VipMasterIC/IC/HIRO/HIRO-S-A0008069061/HIRO-S-A0008410557-1.pdf?src-supplier=IHS+Markit; ComponentLink2URL: https://datasheet.ciiva.com/16410/ed-a3-20130408-16410581.pdf?src-supplier=Future+Electronics; ComponentLink2Description: https://datasheet.ciiva.com/16410/ed-a3-20130408-16410581.pdf?src-supplier=Future+Electronics
JP1 = 10129378-902002BLF: Conn Unshrouded Header HDR 2 POS 2.54mm Solder ST Thru-Hole Poly Bag; Manufacturer: Amphenol ICC / FCI; Supplier: Mouser; Supplier Part Number: 649-1012937890202BLF; Manufacturer Part Number: 10129378-902002BLF; RoHS: No; Category: Connectors; Stock: 18569; Pricing: 1=0,1, 10=0,048, 50=0,048, 100=0,037, 1000=0,029, 10000=0,026 (USD); ComponentLink1URL: https://datasheet.octopart.com/10129378-902002BLF-Amphenol-ICC-datasheet-100454231.pdf?src-supplier=Newark; ComponentLink1Description: https://datasheet.octopart.com/10129378-902002BLF-Amphenol-ICC-datasheet-100454231.pdf?src-supplier=Newark
L1 L2 = MLZ1608N4R7LTD25: SMD / SMT Inductors (Coils), L=4.7?H, L x W x T :; Manufacturer_Name: TDK; Geometry.Height: 0.95mm; Mouser Part Number: 810-MLZ1608N4R7LTD25; Mouser Price/Stock: https://www.mouser.com/Search/Refine.aspx?Keyword=810-MLZ1608N4R7LTD25; Manufacturer_Part_Number: MLZ1608N4R7LTD25; Datasheet Link: https://componentsearchengine.com/Datasheets/1/MLZ1608N4R7LTD25.pdf
MIC1 = MP34DT05TR-A: Consumer Circuit, CMOS, CBGA4; Manufacturer: STMicroelectronics; Package Body Material: Metal; Channels: 1; Max Supply Voltage: 3.6V; Min Supply Voltage: 1.6V; Supplier: Mouser; Supplier Part Number: 511-MP34DT05TR-A; Manufacturer Part Number: MP34DT05TR-A; RoHS: Yes; Category: Microphones; Stock: 14413; Pricing: 1=1,64, 10=1,37, 50=1,19, 100=1,12, 1000=0,904, 10000=0,876 (USD); Case/Package: LGA; Pins: 4; Package Shape: Rectangular; Terminal Finish: Nickel; Min Operating Temperature: -40°C; Max Operating Temperature: 85°C; JESD-609 Code: e4; Consumer IC Type: CONSUMER CIRCUIT; Moisture Sensitivity Level: 3; Package Style: GRID ARRAYMeter; Surface Mount: Yes; Technology: CMOS; Terminal Form: BUTT; Terminal Position: BOTTOM; Length: 4mm; Width: 3mm; Height - Seated (Max): 1.1mm; Temperature Grade: INDUSTRIAL; Reach SVHC Compliant: Yes; RoHS Compliant: Yes; ComponentLink1URL: https://datasheet.ciiva.com:443/pdfs/VipMasterIC/IC/SGST/SGST-S-A0008042494/SGST-S-A0008042494-1.pdf?src-supplier=IHS+Markit; ComponentLink1Description: https://datasheet.ciiva.com:443/pdfs/VipMasterIC/IC/SGST/SGST-S-A0008042494/SGST-S-A0008042494-1.pdf?src-supplier=IHS+Markit; ComponentLink2URL: http://www.farnell.com/datasheets/2600073.pdf?src-supplier=Farnell; ComponentLink2Description: http://www.farnell.com/datasheets/2600073.pdf?src-supplier=Farnell; ComponentLink3URL: http://www.st.com/content/ccc/resource/technical/document/datasheet/group3/c7/90/d3/f6/b7/e7/40/c8/DM00415595/files/DM00415595.pdf/jcr:content/translations/en.DM00415595.pdf?src-supplier=Digikey; ComponentLink3Description: http://www.st.com/content/ccc/resource/technical/document/datasheet/group3/c7/90/d3/f6/b7/e7/40/c8/DM00415595/files/DM00415595.pdf/jcr:content/translations/en.DM00415595.pdf?src-supplier=Digikey
PV1 = PTV09A-4015U-A104: Potentiometer, Carbon, 0.05W, 100000ohm, 20V, 20% +/-Tol, 1 Turn(s); Manufacturer: Bourns; Power: 50mW; Value: 100kR; Rotational Angle: 280°; Package Height: 7.5mm; Package Length: 9.8mm; Package Width: 12mm; Supplier: Mouser; Supplier Part Number: 652-PTV09A-4015UA104; Manufacturer Part Number: PTV09A-4015U-A104; RoHS: Yes; Stock: 1316; Pricing: 1=0,86, 10=0,653, 50=0,653, 100=0,574, 1000=0,453, 10000=0,423 (USD); Case/Package: 3947; Min Operating Temperature: -10°C; Max Operating Temperature: 50°C; Tolerance: 20%; Resistor Type: Potentiometer; Construction: SQUARE; Technology: CARBON; Working Voltage: 20V; Reach SVHC Compliant: Yes; RoHS Compliant: Yes; ComponentLink1URL: https://datasheet.ciiva.com:443/pdfs/VipMasterIC/IC/BOUR/BOUR-S-A0000201073/BOUR-S-A0000201073-1.pdf?src-supplier=IHS+Markit; ComponentLink1Description: https://datasheet.ciiva.com:443/pdfs/VipMasterIC/IC/BOUR/BOUR-S-A0000201073/BOUR-S-A0000201073-1.pdf?src-supplier=IHS+Markit; ComponentLink2URL: http://www.bourns.com/docs/Product-Datasheets/PTV09.pdf?src-supplier=Digikey; ComponentLink2Description: http://www.bourns.com/docs/Product-Datasheets/PTV09.pdf?src-supplier=Digikey
Q1 = TSM3446CX6 RFG: 20V, 5.3A, Single N-Channel Power MOSFET; Manufacturer: Taiwan Semiconductor; Supplier: Mouser; Supplier Part Number: 821-TSM3446CX6RFG; Manufacturer Part Number: TSM3446CX6 RFG; Stock: 5369; Pricing: 1=0,15, 10=0,13, 50=0,13, 100=0,125, 1000=0,125, 10000=0,125 (USD); ComponentLink1URL: https://datasheet.ciiva.com:443/pdfs/VipMasterIC/IC/TWSC/TWSC-S-A0001064014/TWSC-S-A0001064014-1.pdf?src-supplier=IHS+Markit; ComponentLink1Description: https://datasheet.ciiva.com:443/pdfs/VipMasterIC/IC/TWSC/TWSC-S-A0001064014/TWSC-S-A0001064014-1.pdf?src-supplier=IHS+Markit; ComponentLink2URL: http://www.taiwansemi.com/products/datasheet/TSM3446_E15.pdf?src-supplier=Digikey; ComponentLink2Description: http://www.taiwansemi.com/products/datasheet/TSM3446_E15.pdf?src-supplier=Digikey; ComponentLink3URL: https://datasheet.octopart.com/TSM3446CX6-RFG-Taiwan-Semiconductor-datasheet-14717451.pdf?src-supplier=Element14; ComponentLink3Description: https://datasheet.octopart.com/TSM3446CX6-RFG-Taiwan-Semiconductor-datasheet-14717451.pdf?src-supplier=Element14
Q2 = BC848CLT1G: Small Signal Bipolar Transistor, 0.1A I(C), 30V V(BR)CEO, 1-Element, NPN, Silicon, TO-236; Manufacturer: ON Semiconductor; Package Body Material: Plastic; Max Collector Current: 100mA; DC Current Gain-Min (hFE): 420; Number of Elements: 1; Power Dissipation-Max (Abs): 300mW; Time @ Peak Reflow Temperature-Max (s): 40s; Frequency: 100MHz; Qualification Status: Not Qualified; Supplier: Mouser; Supplier Part Number: 863-BC848CLT1G; Manufacturer Part Number: BC848CLT1G; RoHS: Yes; Category: BJTs; Stock: 105869; Pricing: 1=0,13, 10=0,08, 50=0,08, 100=0,05, 1000=0,032, 10000=0,02 (USD); Pins: 3; Package Shape: Rectangular; Terminal Finish: Tin; Transistor Element Material: SILICON; Max Operating Temperature: 150°C; JESD-609 Code: e3; Polarity/Channel Type: NPN; Collector-emitter Voltage-Max: 30V; JESD-30 Code: R-PDSO-G3; Moisture Sensitivity Level: 1; Package Style: SMALL OUTLINEMeter; Peak Reflow Temperature (Cel): 260°C; Surface Mount: Yes; Terminal Form: Gull Wing; Terminal Position: DUAL; JEDEC-95 Code: TO-236; Reach SVHC Compliant: Yes; RoHS Compliant: Yes; ComponentLink1URL: https://datasheet.ciiva.com:443/pdfs/VipMasterIC/IC/ONSM/ONSM-S-A0009451914/ONSM-S-A0009451914-1.pdf?src-supplier=IHS+Markit; ComponentLink1Description: https://datasheet.ciiva.com:443/pdfs/VipMasterIC/IC/ONSM/ONSM-S-A0009451914/ONSM-S-A0009451914-1.pdf?src-supplier=IHS+Markit; ComponentLink2URL: https://datasheet.ciiva.com/4722/bc846alt1-d-108909-4722112.pdf?src-supplier=Mouser; ComponentLink2Description: https://datasheet.ciiva.com/4722/bc846alt1-d-108909-4722112.pdf?src-supplier=Mouser; ComponentLink3URL: https://datasheet.ciiva.com/15138/getdatasheetpartid-68998-15138954.pdf?src-supplier=Verical; ComponentLink3Description: https://datasheet.ciiva.com/15138/getdatasheetpartid-68998-15138954.pdf?src-supplier=Verical; ComponentLink4URL: https://datasheet.ciiva.com/7971/bc846alt1-d-7971966.pdf?src-supplier=Element14; ComponentLink4Description: https://datasheet.ciiva.com/7971/bc846alt1-d-7971966.pdf?src-supplier=Element14; ComponentLink5URL: https://datasheet.ciiva.com/7971/bc846alt1-d-7971964.pdf?src-supplier=Element14; ComponentLink5Description: https://datasheet.ciiva.com/7971/bc846alt1-d-7971964.pdf?src-supplier=Element14; ComponentLink6URL: https://datasheet.ciiva.com/11202/bc846alt1-d-11202104.pdf?src-supplier=Avnet; ComponentLink6Description: https://datasheet.ciiva.com/11202/bc846alt1-d-11202104.pdf?src-supplier=Avnet; ComponentLink7URL: https://datasheet.ciiva.com/16351/bc846alt1-d-16351381.pdf?src-supplier=Future+Electronics; ComponentLink7Description: https://datasheet.ciiva.com/16351/bc846alt1-d-16351381.pdf?src-supplier=Future+Electronics
R1-R5 R7 R8 R11-R24 R26-R29 R32-R34 = Resistor: No model resistor
R6 R9 R10 = RC0603JR-0710KP: Thick Film Resistors - SMD 10 kOhms 100 mW 0603 5%; Manufacturer: Yageo; Value: 10kR; Max Power Dissipation: 100mW; Temperature Coefficient: 150ppm/°C; Supplier: Mouser; Supplier Part Number: 603-RC0603JR-0710KP; Manufacturer Part Number: RC0603JR-0710KP; RoHS: Yes; Category: Chip SMD Resistors; Stock: 47636; Pricing: 1=0,1, 10=0,017, 50=0,017, 100=0,01, 1000=0,008, 10000=0,004 (USD); Case/Package: 0603; Case Code (Metric): 1608; Case Code (Imperial): 0603; Min Operating Temperature: -55°C; Max Operating Temperature: 155°C; Packaging: Cut Tape; Number of Terminations: 2; Tolerance: 5%; Features: Moisture Resistant; Series: RC-P Lead Free; Length: 0.063inch; Width: 0.031inch; Height: 0.022inch; RoHS Compliant: Yes; ComponentLink1URL: http://www.yageo.com/NewPortal/yageodocoutput?fileName=/pdf/R-Chip/PYu-RC_51_RoHS_P_0.pdf&src-supplier=Digikey; ComponentLink1Description: http://www.yageo.com/NewPortal/yageodocoutput?fileName=/pdf/R-Chip/PYu-RC_51_RoHS_P_0.pdf&src-supplier=Digikey
S1-S3 = TS02-66-50-BK-260-SCR-D: Switch Tactile OFF (ON) SPST Round Button PC Pins 0.05A 12VDC 60000Cycles 2.6N Thru-Hole Bag; Manufacturer: CUI Devices; Supplier: Mouser; Supplier Part Number: 179-TS026650BK260SCR; Manufacturer Part Number: TS02-66-50-BK-260-SCR-D; RoHS: No; Category: Tactile Switches; Stock: 2413; Pricing: 1=0,1, 10=0,062, 50=0,062, 100=0,054, 1000=0,042, 10000=0,041 (USD)
SPK1 = SC400308-1: SC Series 2 W 8 O 20 kHz Rectangular Frame Mount Dynamic Speaker; Manufacturer: DB Unlimited; Supplier: Mouser; Supplier Part Number: 497-SC400308-1; Manufacturer Part Number: SC400308-1; RoHS: No; Stock: 575; Pricing: 1=3,42, 10=2,79, 50=2,31, 100=2,11, 1000=1,87, 10000=1,87 (USD); ComponentLink1URL: http://dbunlimitedco.com/images/product_images/2D-Drawings/SC400308-1.pdf?src-supplier=Digikey; ComponentLink1Description: http://dbunlimitedco.com/images/product_images/2D-Drawings/SC400308-1.pdf?src-supplier=Digikey
U1 = FT230XS-U: USB Interface IC USB to Basic Serial UART IC SSOP-16; Manufacturer_Name: FTDI Chip; Geometry.Height: 1.753mm; Mouser Part Number: 895-FT230XS-U; Mouser Price/Stock: https://www.mouser.co.uk/ProductDetail/FTDI/FT230XS-U?qs=Gp1Yz1mis3UZolxbXux7lw%3D%3D; Manufacturer_Part_Number: FT230XS-U; Datasheet Link: https://www.ftdichip.com/Support/Documents/DataSheets/ICs/DS_FT230X.pdf
U2 = STM32U545CEU6Q: MCU 32-bit ARM Cortex M33 RISC 512KB Flash 1.8V/2.5V/3.3V 48-Pin UFQFPN EP Tray; Manufacturer: STMicroelectronics; Supplier: Mouser; Supplier Part Number: 511-STM32U545CEU6Q; Manufacturer Part Number: STM32U545CEU6Q; RoHS: No; Category: Microcontrollers; Stock: 1061; Pricing: 1=6,6, 10=5,96, 50=5,69, 100=4,94, 1000=3,75, 10000=3,75 (USD); ComponentLink1Description: SMPS Connection; ComponentLink1URL: https://community.st.com/t5/stm32-mcus/how-do-i-connect-the-stm32-s-smps-switched-mode-power-supply/ta-p/49590
U3 = RFM22: ISM transceiver module 1.8-3.6V 240-930MHz +17dBm; ComponentLink1Description: Datasheet; ComponentLink1URL: https://www.sparkfun.com/datasheets/Wireless/General/RFM22.PDF
U4 = ADXL343BCCZ-RL7: Accelerometer Triple ±2/±4/±8/±16g 2V to 3.6V 14-Pin LGA T/R; Manufacturer: Analog Devices; Bandwidth: 0.05Hz; Interface: I2C,SPI; -3db Bandwidth: 320Hz; Output Type: Digital; Axis: X, Y, Z; Sensitivity: 256LSB/g; Supply Current: 140uA; Supplier: Mouser; Supplier Part Number: 584-ADXL343BCCZ-R7; Manufacturer Part Number: ADXL343BCCZ-RL7; RoHS: Yes; Category: Accelerometers; Stock: 30976; Pricing: 1=4,09, 10=2,7, 50=2,7, 100=2,62, 1000=2,1, 10000=1,96 (USD); Case/Package: LGA; Pins: 14; Contact Plating: Tin,Matte; Min Operating Temperature: -40°C; Max Operating Temperature: 85°C; Package Quantity: 1500; Max Supply Voltage: 3.6V; Min Supply Voltage: 2V; Packaging: Tape and Reel; Series: -; Lead Free: Contains Lead; RoHS Compliant: Yes; ComponentLink1URL: http://www.farnell.com/datasheets/2243358.pdf?src-supplier=Farnell; ComponentLink1Description: http://www.farnell.com/datasheets/2243358.pdf?src-supplier=Farnell; ComponentLink2URL: http://www.mouser.com/ds/2/609/ADXL343-879234.pdf?src-supplier=Mouser; ComponentLink2Description: http://www.mouser.com/ds/2/609/ADXL343-879234.pdf?src-supplier=Mouser; ComponentLink3URL: http://components.arrow.com/part/dataview/52586911S6181N2771?src-supplier=Arrow+Electronics; ComponentLink3Description: http://components.arrow.com/part/dataview/52586911S6181N2771?src-supplier=Arrow+Electronics; ComponentLink4URL: http://www.farnell.com/datasheets/2243358.pdf?src-supplier=Newark; ComponentLink4Description: http://www.farnell.com/datasheets/2243358.pdf?src-supplier=Newark; ComponentLink5URL: https://datasheet.octopart.com/ADXL343BCCZ-RL7-Analog-Devices-datasheet-165826994.pdf?src-supplier=Element14; ComponentLink5Description: https://datasheet.octopart.com/ADXL343BCCZ-RL7-Analog-Devices-datasheet-165826994.pdf?src-supplier=Element14; ComponentLink6URL: https://datasheet.octopart.com/ADXL343BCCZ-RL7-Analog-Devices-datasheet-78834203.pdf?src-supplier=Newark; ComponentLink6Description: https://datasheet.octopart.com/ADXL343BCCZ-RL7-Analog-Devices-datasheet-78834203.pdf?src-supplier=Newark; ComponentLink7URL: http://www.analog.com/static/imported-files/data_sheets/ADXL343.pdf?src-supplier=Avnet; ComponentLink7Description: http://www.analog.com/static/imported-files/data_sheets/ADXL343.pdf?src-supplier=Avnet
U5 = TSOP34838: Logic Output Photo IC; Manufacturer: Vishay; Shape: Round; Application(s): REMOTE CONTROL; Infrared Range: Yes; Channels: 1; On-State Current-Max: 5mA; Min Supply Voltage: 2.5V; Supplier: Mouser; Supplier Part Number: 782-TSOP34838; Manufacturer Part Number: TSOP34838; RoHS: Yes; Category: Optical Sensors; Stock: 10444; Pricing: 1=0,63, 10=0,462, 50=0,462, 100=0,441, 1000=0,428, 10000=0,425 (USD); Terminal Finish: Tin; Min Operating Temperature: -25°C; Max Operating Temperature: 85°C; JESD-609 Code: e3; Optoelectronic Device Type: LOGIC OUTPUT PHOTO IC; Size: 5mm; RoHS Compliant: Yes; ComponentLink1URL: https://datasheet.ciiva.com:443/pdfs/VipMasterIC/IC/VSMI/VSMIS33601/VSMIS33601-1.pdf?src-supplier=IHS+Markit; ComponentLink1Description: https://datasheet.ciiva.com:443/pdfs/VipMasterIC/IC/VSMI/VSMIS33601/VSMIS33601-1.pdf?src-supplier=IHS+Markit; ComponentLink2URL: https://datasheet.ciiva.com/1235/tsop348xx-1235248.pdf?src-supplier=Element14; ComponentLink2Description: https://datasheet.ciiva.com/1235/tsop348xx-1235248.pdf?src-supplier=Element14; ComponentLink3URL: https://datasheet.ciiva.com/1235/1699654-1235025.pdf?src-supplier=Element14; ComponentLink3Description: https://datasheet.ciiva.com/1235/1699654-1235025.pdf?src-supplier=Element14; ComponentLink4URL: https://datasheet.ciiva.com/11770/0900766b80dd0627-11770107.pdf?src-supplier=Rs; ComponentLink4Description: https://datasheet.ciiva.com/11770/0900766b80dd0627-11770107.pdf?src-supplier=Rs; ComponentLink5URL: https://datasheet.ciiva.com/2821/tsop322-2821296.pdf?src-supplier=Digikey; ComponentLink5Description: https://datasheet.ciiva.com/2821/tsop322-2821296.pdf?src-supplier=Digikey; ComponentLink6URL: https://datasheet.ciiva.com/1238/tsop348xx-1238483.pdf?src-supplier=Farnell; ComponentLink6Description: https://datasheet.ciiva.com/1238/tsop348xx-1238483.pdf?src-supplier=Farnell; ComponentLink7URL: https://datasheet.ciiva.com/3150/tsop322-3150886.pdf?src-supplier=Avnet; ComponentLink7Description: https://datasheet.ciiva.com/3150/tsop322-3150886.pdf?src-supplier=Avnet; ComponentLink8URL: https://datasheet.ciiva.com/16513/tsop322-16513770.pdf?src-supplier=Future+Electronics; ComponentLink8Description: https://datasheet.ciiva.com/16513/tsop322-16513770.pdf?src-supplier=Future+Electronics
U6 = TPA2013D1RGPR: Audio Amplifier, 2.7W, 2 Channel(s), 1 Func, PQCC20; Manufacturer: Texas Instruments; Package Body Material: Plastic; Number of Channels: 2; Channels: 1; Power Supplies: 2.5V; Max Supply Current: 6mA; Max Supply Voltage: 5.5V; Min Supply Voltage: 1.8V; Qualification Status: Not Qualified; Supplier: Mouser; Supplier Part Number: 595-TPA2013D1RGPR; Manufacturer Part Number: TPA2013D1RGPR; RoHS: Yes; Category: Amplifiers - Audio; Stock: 15961; Pricing: 1=1,25, 10=1,11, 50=1,11, 100=0,94, 1000=0,739, 10000=0,531 (USD); Case/Package: HVQCCN; Pins: 20; Package Shape: Square; Terminal Finish: Nickel; Min Operating Temperature: -40°C; Max Operating Temperature: 85°C; JESD-609 Code: e4; Consumer IC Type: AUDIO AMPLIFIER; Moisture Sensitivity Level: 3; Output Power-Nom: 2.7W; Package Style: CHIP CARRIER, HEAT SINK/SLUG, VERY THIN PROFILEMeter; Peak Reflow Temperature (Cel): 260°C; Surface Mount: Yes; Terminal Form: No Lead; Terminal Position: QUAD; Length: 4mm; Width: 4mm; Height - Seated (Max): 1mm; Terminal Pitch: 0.5mm; Temperature Grade: INDUSTRIAL; RoHS Compliant: Yes; Reach SVHC Compliant: Yes; ComponentLink1URL: https://www.ti.com:443/lit/ds/symlink/tpa2013d1.pdf?src-supplier=IHS+Markit; ComponentLink1Description: https://www.ti.com:443/lit/ds/symlink/tpa2013d1.pdf?src-supplier=IHS+Markit; ComponentLink2URL: https://datasheet.ciiva.com/4767/slos520-122214-4767234.pdf?src-supplier=Mouser; ComponentLink2Description: https://datasheet.ciiva.com/4767/slos520-122214-4767234.pdf?src-supplier=Mouser; ComponentLink3URL: https://datasheet.ciiva.com/2967/tpa2013d1-2967857.pdf?src-supplier=Avnet; ComponentLink3Description: https://datasheet.ciiva.com/2967/tpa2013d1-2967857.pdf?src-supplier=Avnet; ComponentLink4URL: https://datasheet.ciiva.com/23806/1716606-23806566.pdf?src-supplier=Newark; ComponentLink4Description: https://datasheet.ciiva.com/23806/1716606-23806566.pdf?src-supplier=Newark; ComponentLink5URL: https://datasheet.ciiva.com/15131/getdatasheetpartid-172140-15131746.pdf?src-supplier=Verical; ComponentLink5Description: https://datasheet.ciiva.com/15131/getdatasheetpartid-172140-15131746.pdf?src-supplier=Verical; ComponentLink6URL: https://datasheet.ciiva.com/2968/tpa2013d1-2968137.pdf?src-supplier=Avnet; ComponentLink6Description: https://datasheet.ciiva.com/2968/tpa2013d1-2968137.pdf?src-supplier=Avnet; ComponentLink7URL: https://datasheet.ciiva.com/22654/1885891-22654842.pdf?src-supplier=Element14; ComponentLink7Description: https://datasheet.ciiva.com/22654/1885891-22654842.pdf?src-supplier=Element14; ComponentLink8URL: https://datasheet.ciiva.com/1789/tpa2013d1-1789061.pdf?src-supplier=Digikey; ComponentLink8Description: https://datasheet.ciiva.com/1789/tpa2013d1-1789061.pdf?src-supplier=Digikey; ComponentLink9URL: https://datasheet.ciiva.com/1789/tpa2013d1-1789062.pdf?src-supplier=Digikey; ComponentLink9Description: https://datasheet.ciiva.com/1789/tpa2013d1-1789062.pdf?src-supplier=Digikey; ComponentLink10URL: https://datasheet.ciiva.com/1789/tpa2013d1-1789063.pdf?src-supplier=Digikey; ComponentLink10Description: https://datasheet.ciiva.com/1789/tpa2013d1-1789063.pdf?src-supplier=Digikey
U7 = BMP390: Board Mount Pressure Sensor 300hPa to 1250hPa Barometric 10-Pin LGA Module T/R; Manufacturer: Bosch Tools; Supplier: Mouser; Supplier Part Number: 262-BMP390; Manufacturer Part Number: BMP390; RoHS: No; Category: Linear ICs; Stock: 8779; Pricing: 1=2,77, 10=2,36, 50=2,36, 100=2,26, 1000=1,96, 10000=1,78 (USD)